# EAGLE design VCF-1-Thomas-Henry-TL072 (EAGLE 7.6.0)

## Sheet 1 of 2
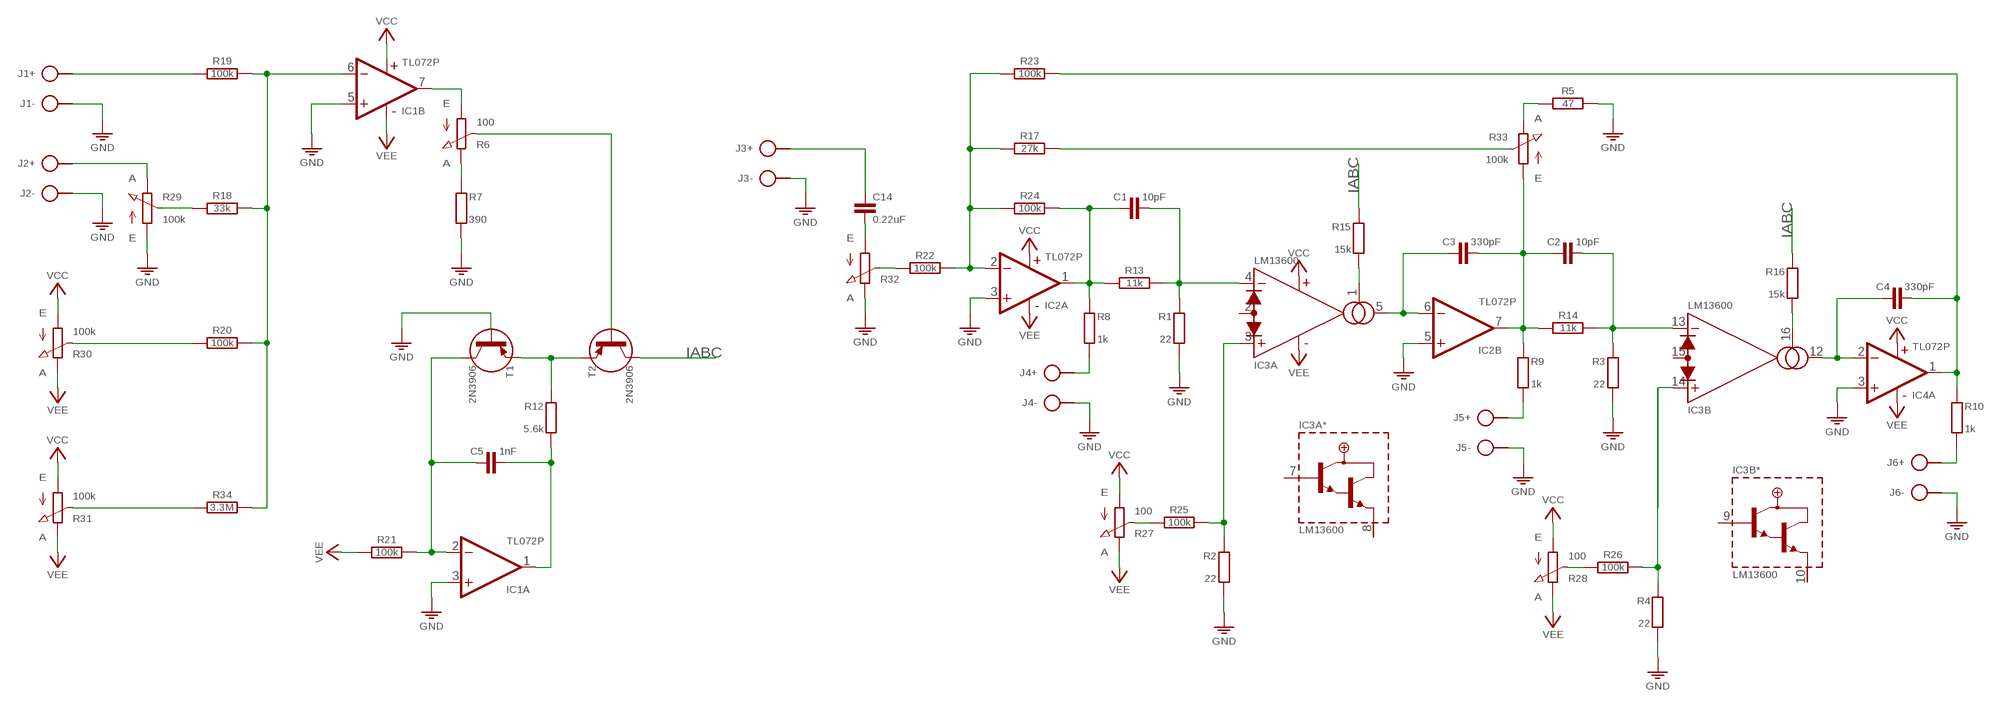
[diagram p0: schematic, sheet 1]

### Parts
C1  10pF  C-H050-020X036  [C050-020X036]
C2  10pF  C-H050-020X036  [C050-020X036]
C3  330pF  C-H050-020X036  [C050-020X036]
C4  330pF  C-H050-020X036  [C050-020X036]
C5  1nF  C-H050-020X036  [C050-020X036]
C14  0.22uF  C050-020X044/V  [C050-020X044/V]
IC1  TL072P  [DIL08]
IC2  TL072P  [DIL08]
IC3  LM13600  [DIL16]
IC4  TL072P  [DIL08]
J1  1V/Oct  SPAD+--+  [SPAD-+]
J2  Envelope  SPAD+--+  [SPAD-+]
J3  AUDIO INPUT  SPAD+--+  [SPAD-+]
J4  HIGH PASS  SPAD+-+-  [SPAD+-]
J5  BAND PASS  SPAD+--+  [SPAD-+]
J6  LOW PASS  SPAD+--+  [SPAD-+]
R1  22  R0204/10-V  [0204/10-V]
R2  22  R0204/10-V  [0204/10-V]
R3  22  R0204/10-V  [0204/10-V]
R4  22  R0204/10-V  [0204/10-V]
R5  47  R-H0204/10  [0204/10]
R6  100  POT-V  [POT-V]
R7  390  R0204/10-V  [0204/10-V]
R8  1k  R0204/10-V  [0204/10-V]
R9  1k  R0204/10-V  [0204/10-V]
R10  1k  R0204/10-V  [0204/10-V]
R12  5.6k  R0204/10-V  [0204/10-V]
R13  11k  R-H0204/10  [0204/10]
R14  11k  R-H0204/10  [0204/10]
R15  15k  R0204/10-V  [0204/10-V]
R16  15k  R0204/10-V  [0204/10-V]
R17  27k  R-H0204/10  [0204/10]
R18  33k  R-H0204/10  [0204/10]
R19  100k  R-H0204/10  [0204/10]
R20  100k  R-H0204/10  [0204/10]
R21  100k  R-H0204/10  [0204/10]
R22  100k  R-H0204/10  [0204/10]
R23  100k  R-H0204/10  [0204/10]
R24  100k  R-H0204/10  [0204/10]
R25  100k  R-H0204/10  [0204/10]
R26  100k  R-H0204/10  [0204/10]
R27  100  POT-V  [POT-V]
R28  100  POT-V  [POT-V]
R29  100k  POT  [POT]
R30  100k  POT  [POT]
R31  100k  POT  [POT]
R32  POT  [POT]
R33  100k  POT  [POT]
R34  3.3M  R-H0204/10  [0204/10]
T1  2N3906  [TO92]
T2  2N3906  [TO92]

### Nets
GND: IC1.3(A:+IN) IC1.5(B:+IN) IC2.3(A:+IN) IC2.5(B:+IN) IC4.3(A:+IN) J1.1 J2.1 J3.1 J4.1 J5.1 J6.1 R1.2 R2.2 R3.2 R4.2 R5.2 R7.2 R29.1(A) R32.3(E) T1.2(B)
IABC: R15.1 R16.1 T2.3(C)
N$1: J1.2 R19.1
N$2: R18.1 R29.2(S)
N$3: J2.2 R29.3(E)
N$4: R20.1 R30.2(S)
N$5: R31.2(S) R34.1
N$6: IC1.6(B:-IN) R18.2 R19.2 R20.2 R34.2
N$7: IC1.7(B:OUT) R6.A
N$8: R6.E R7.1
N$9: R12.1 T1.1(E) T2.1(E)
N$10: C5.2 IC1.1(A:OUT) R12.2
N$11: C5.1 IC1.2(A:-IN) R21.2 T1.3(C)
N$12: R6.S T2.2(B)
N$13: R22.1 R32.2(S)
N$14: IC2.2(A:-IN) R17.1 R22.2 R23.1 R24.1
N$15: C1.1 IC2.1(A:OUT) R8.1 R13.1 R24.2
N$16: C1.2 IC3.4(A:-IN) R1.1 R13.2
N$17: J4.2 R8.2
N$18: IC3.1(A:AMP/BIAS) R15.2
N$19: C3.1 IC2.6(B:-IN) IC3.5(A:OUT)
N$20: C2.1 C3.2 IC2.7(B:OUT) R9.1 R14.1 R33.1(A)
N$21: J5.2 R9.2
N$22: C2.2 IC3.13(B:-IN) R3.1 R14.2
N$23: IC3.14(B:+IN)
N$24: R25.1 R27.S
N$25: IC3.3(A:+IN) R2.1 R25.2
N$26: R26.1 R28.S
N$27: R4.1 R26.2
N$28: IC3.16(B:AMP/BIAS) R16.2
N$29: C4.1 IC3.12(B:OUT) IC4.2(A:-IN)
N$30: C4.2 IC4.1(A:OUT) R10.1 R23.2
N$31: J6.2 R10.2
N$32: R17.2 R33.2(S)
N$33: R5.1 R33.3(E)
N$34: C14.1 J3.2
N$35: C14.2 R32.1(A)
VCC: IC1.8(P:V+) IC2.8(P:V+) IC3.11(V+) IC4.8(P:V+) R27.A R28.A R30.1(A) R31.1(A)
VEE: IC1.4(P:V-) IC2.4(P:V-) IC3.6(V-) IC4.4(P:V-) R21.1 R27.E R28.E R30.3(E) R31.3(E)
Unconnected: IC3.2(A:DIODE/BIAS) IC3.7(A*:BUFF/IN) IC3.8(A*:BUFF/OUT) IC3.9(B*:BUFF/IN) IC3.10(B*:BUFF/OUT) IC3.15(B:DIODE/BIAS) IC4.5(B:+IN) IC4.6(B:-IN) IC4.7(B:OUT)

## Sheet 2 of 2

## Library data of the parts
C1-C5 = c:C-H
C14 = c:C: CAPACITOR, European symbol
IC1 IC2 IC4 = ic:TL072: Low-Noise JFET-Input Operational Amplifiers http://www.ti.com/lit/ds/symlink/tl072.pdf
IC3 = ic:LM13600
J1-J6 = pad:SPAD+-
R1-R4 R7-R10 R12 R15 R16 = r:R: RESISTOR, European symbol
R5 R13 R14 R17-R26 R34 = r:R-H
R6 R27-R33 = r:POT
T1 T2 = t:2N3906

## Net classes
0 default: width 0.61 mm

## Board
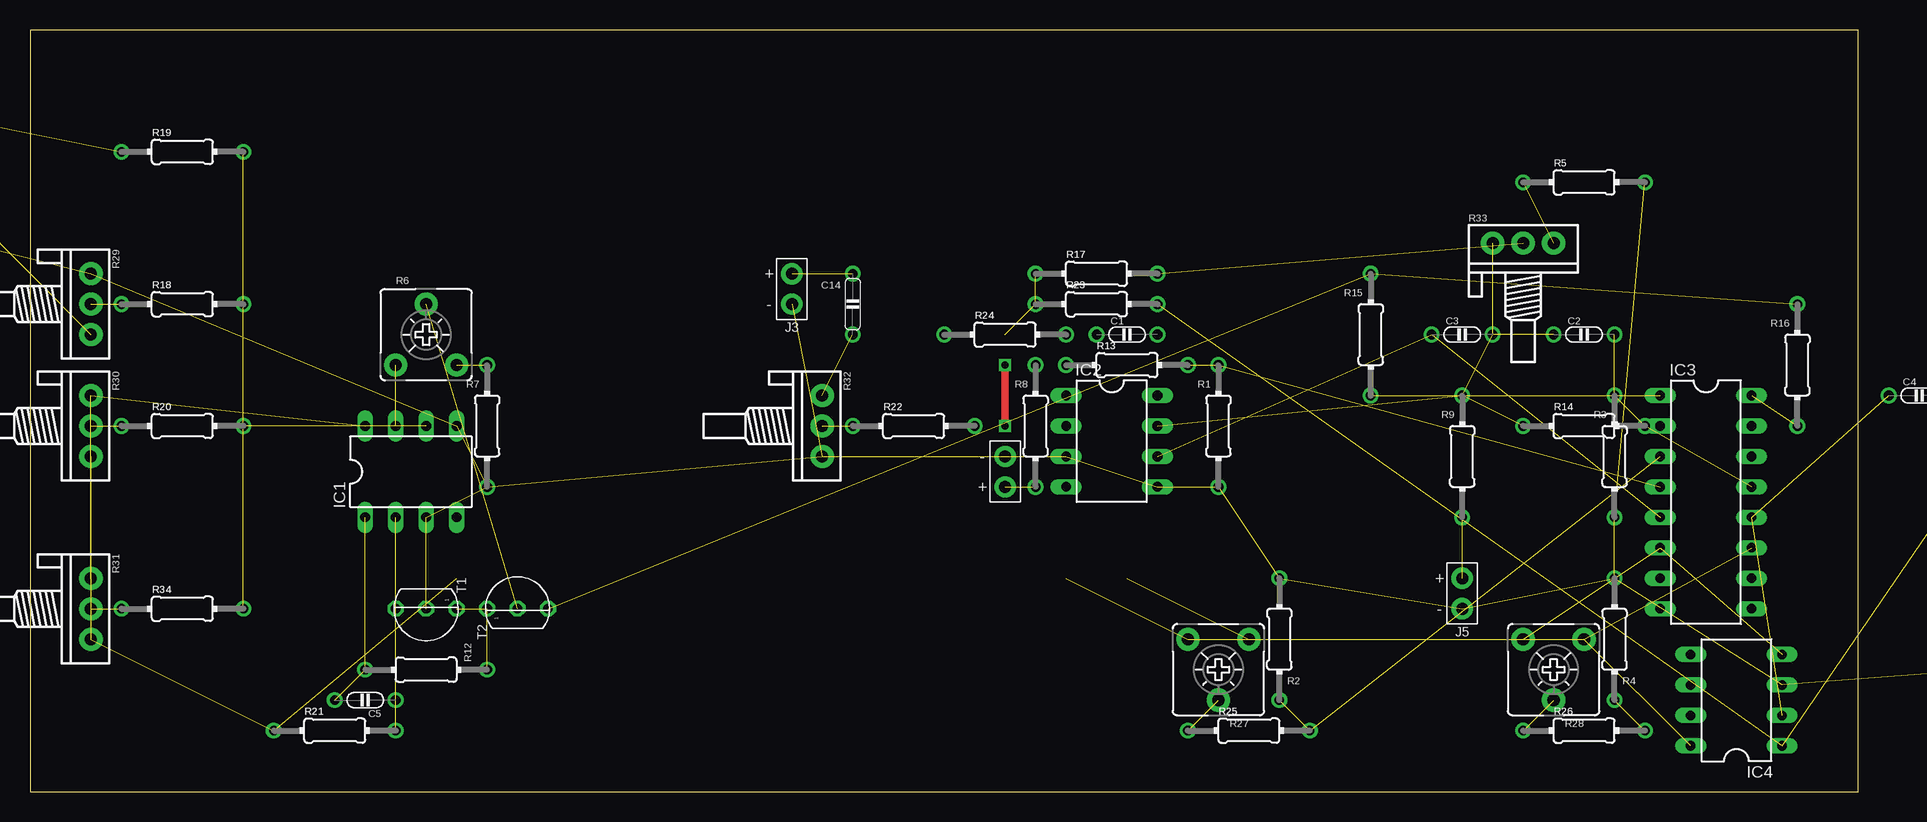
[diagram p1: board, top side]
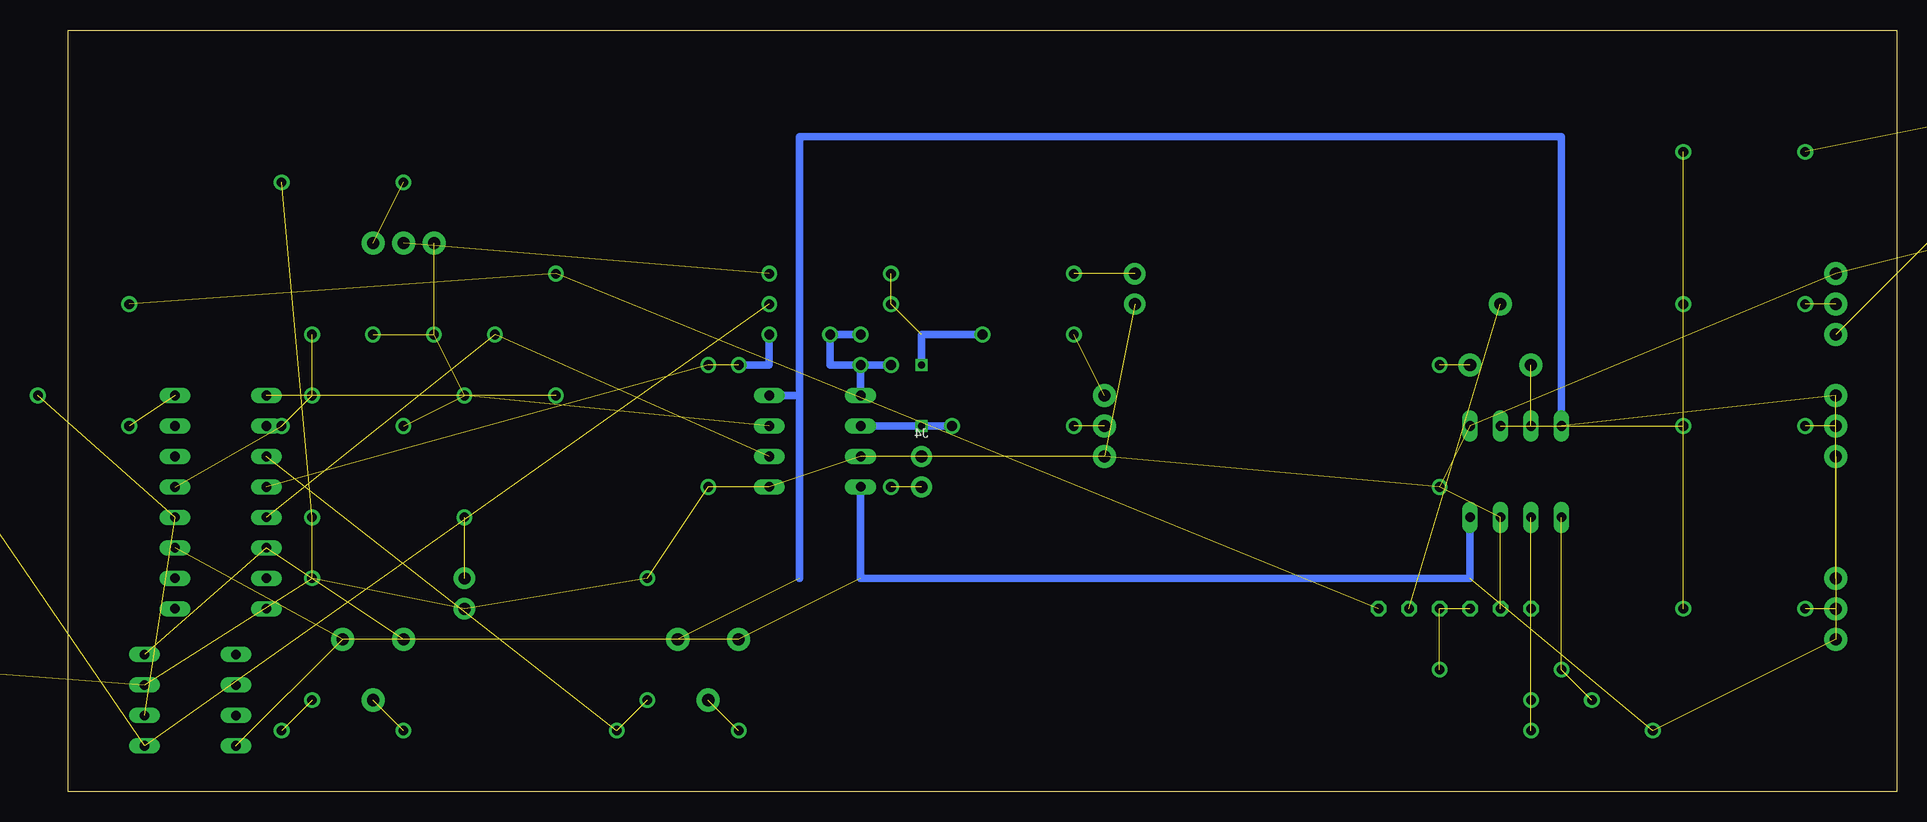
[diagram p2: board, bottom side, seen from below]

Size 152.4 x 63.5 mm. Coordinates in mm from the lower left corner, seen from the top.
Outline: 0,0 152.4,0 152.4,63.5 0,63.5 0,0
Copper layers (1*16): Top 0.035mm / dielectric 1.5mm / Bottom 0.035mm
Design rules "default": minimum track width 10mil, minimum drill 24mil, track to track 8mil, track to pad 8mil, pad to pad 8mil, via to via 8mil, smd to smd 8mil, copper to edge 40mil, drill to drill 8mil, minimum pad ring 10mil, minimum via ring 8mil, stop-mask expansion 4mil, vias tented up to drill 0mil, thermal gap 10mil

### Footprints (pad centres in the part's own frame; a part is rotated, then mirrored left to right if it is on the bottom)
C050-020X036 = drill 0.8: 1 -2.54,0; 2 2.54,0
C050-020X044/V = drill 0.8: 1 0,2.54; 2 0,-2.54
DIL08 = drill 0.8 pad 1.27 long: 1 -3.81,3.81; 2 -3.81,1.27; 3 -3.81,-1.27; 4 -3.81,-3.81; 5 3.81,-3.81; 6 3.81,-1.27; 7 3.81,1.27; 8 3.81,3.81
DIL16 = drill 0.8 long: 1 -3.81,8.89; 2 -3.81,6.35; 3 -3.81,3.81; 4 -3.81,1.27; 5 -3.81,-1.27; 6 -3.81,-3.81; 7 -3.81,-6.35; 8 -3.81,-8.89; 9 3.81,-8.89; 10 3.81,-6.35; 11 3.81,-3.81; 12 3.81,-1.27; 13 3.81,1.27; 14 3.81,3.81; 15 3.81,6.35; 16 3.81,8.89
SPAD-+ = drill 1 pad 1.778: 1 0,-1.27; 2 0,1.27
SPAD+- = drill 1 pad 1.778: 1 0,-1.27; 2 0,1.27
0204/10-V = drill 0.8: 1 0,5.08; 2 0,-5.08
0204/10 = drill 0.8: 1 -5.08,0; 2 5.08,0
POT-V = drill 1.016 pad 1.93: A -2.54,-2.54; E 2.54,-2.54; S 0,2.54
POT = drill 1 pad 1.93: 1 -2.54,0; 2 0,0; 3 2.54,0
TO92 = drill 0.8 octagon: 1 0,2.54; 2 0,0; 3 0,-2.54

### Placement (x,y rotation side)
C1  91.44,38.1 0 top
C2  129.54,38.1 0 top
C3  119.38,38.1 0 top
C4  157.48,33.02 0 top
C5  27.94,7.62 180 top
C14  68.58,40.64 0 top
IC1  31.75,26.67 90 top
IC2  90.17,29.21 0 top
IC3  139.7,24.13 0 top
IC4  142.24,7.62 180 top
J1  -5.08,54.61 0 top  (outside the outline)
J2  -5.08,46.99 0 top  (outside the outline)
J3  63.5,41.91 0 top
J4  81.28,26.67 180 top
J5  119.38,16.51 0 top
J6  162.56,11.43 0 top  (outside the outline)
R1  99.06,30.48 0 top
R2  104.14,12.7 180 top
R3  132.08,27.94 0 top
R4  132.08,12.7 180 top
R5  129.54,50.8 0 top
R6  33.02,38.1 0 top
R7  38.1,30.48 0 top
R8  83.82,30.48 0 top
R9  119.38,27.94 0 top
R10  162.56,22.86 0 top  (outside the outline)
R12  33.02,10.16 270 top
R13  91.44,35.56 0 top
R14  129.54,30.48 0 top
R15  111.76,38.1 0 top
R16  147.32,35.56 0 top
R17  88.9,43.18 0 top
R18  12.7,40.64 0 top
R19  12.7,53.34 0 top
R20  12.7,30.48 0 top
R21  25.4,5.08 0 top
R22  73.66,30.48 0 top
R23  88.9,40.64 0 top
R24  81.28,38.1 0 top
R25  101.6,5.08 0 top
R26  129.54,5.08 0 top
R27  99.06,10.16 180 top
R28  127,10.16 180 top
R29  5.08,40.64 270 top
R30  5.08,30.48 270 top
R31  5.08,15.24 270 top
R32  66.04,30.48 270 top
R33  124.46,45.72 0 top
R34  12.7,15.24 0 top
T1  33.02,15.24 270 top
T2  40.64,15.24 90 top

### Tracks (layer width: path | path; a pad name or v marks a point on that pad's centre or on a via)
GND  (19 unrouted)
IABC  (2 unrouted)
N$1  (1 unrouted)
N$2  (1 unrouted)
N$3  (1 unrouted)
N$4  (1 unrouted)
N$5  (1 unrouted)
N$6  (4 unrouted)
N$7  (1 unrouted)
N$8  (1 unrouted)
N$9  (2 unrouted)
N$10  (2 unrouted)
N$11  (3 unrouted)
N$12  (1 unrouted)
N$13  (1 unrouted)
N$14  (via drill 0.6)  (2 unrouted)
  Top 0.61: v81.28,30.48 v81.28,35.56
  Bottom 0.61: IC2.2 v81.28,30.48 R22.2 | v81.28,35.56 81.28,38.1 R24.1
N$15
  Bottom 0.61: R24.2 C1.1 88.9,35.56 R13.1 | R8.1 R13.1 | R13.1 IC2.1
N$16  (2 unrouted)
  Bottom 0.61: R13.2 93.98,35.56 C1.2
N$17  (1 unrouted)
N$18  (1 unrouted)
N$19  (2 unrouted)
N$20  (5 unrouted)
N$21  (1 unrouted)
N$22  (3 unrouted)
N$24  (1 unrouted)
N$25  (2 unrouted)
N$26  (1 unrouted)
N$27  (1 unrouted)
N$28  (1 unrouted)
N$29  (2 unrouted)
N$30  (3 unrouted)
N$31  (1 unrouted)
N$32  (1 unrouted)
N$33  (1 unrouted)
N$34  (1 unrouted)
N$35  (1 unrouted)
VCC  (6 unrouted)
  Bottom 0.61: 91.44,33.02 91.44,54.61 27.94,54.61 IC1.8 | IC2.8 91.44,33.02 | 91.44,33.02 91.44,17.78
VEE  (7 unrouted)
  Bottom 0.61: IC1.4 35.56,17.78 86.36,17.78 IC2.4